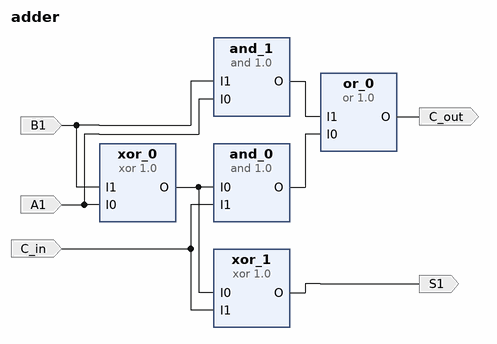
[diagram p0: block diagram of the top level]
# Vivado block design adder, xc7a35tcpg236-1, Vivado 2018.3
create_bd_design adder

create_bd_port -dir I -type data A1
create_bd_port -dir I -type data B1
create_bd_port -dir I -type data C_in
create_bd_port -dir O -type data S1
create_bd_port -dir O -type data C_out

create_bd_cell -type ip -vlnv FIT:user:and:1.0 and_0
create_bd_cell -type ip -vlnv FIT:user:and:1.0 and_1
create_bd_cell -type ip -vlnv FIT:user:or:1.0 or_0
create_bd_cell -type ip -vlnv FIT:user:xor:1.0 xor_0
create_bd_cell -type ip -vlnv FIT:user:xor:1.0 xor_1

# ---- connections ----

connect_bd_net -net I1_0_1 [get_bd_ports B1] [get_bd_pins xor_0/I1] [get_bd_pins and_1/I1]
connect_bd_net -net I1_1_1 [get_bd_ports C_in] [get_bd_pins xor_1/I1] [get_bd_pins and_0/I1]
connect_bd_net [get_bd_pins xor_1/O] [get_bd_ports S1]
connect_bd_net [get_bd_pins xor_0/O] [get_bd_pins xor_1/I0] [get_bd_pins and_0/I0]
connect_bd_net [get_bd_pins and_0/O] [get_bd_pins or_0/I0]
connect_bd_net [get_bd_pins and_1/O] [get_bd_pins or_0/I1]
connect_bd_net -net I0_0_1 [get_bd_ports A1] [get_bd_pins and_1/I0] [get_bd_pins xor_0/I0]
connect_bd_net [get_bd_pins or_0/O] [get_bd_ports C_out]

validate_bd_design
save_bd_design
